# Altium schematic sheet catalog.SchDoc
size A4; Author: whutddk; DrawnBy: WHUTDDK; Revision: 1.0
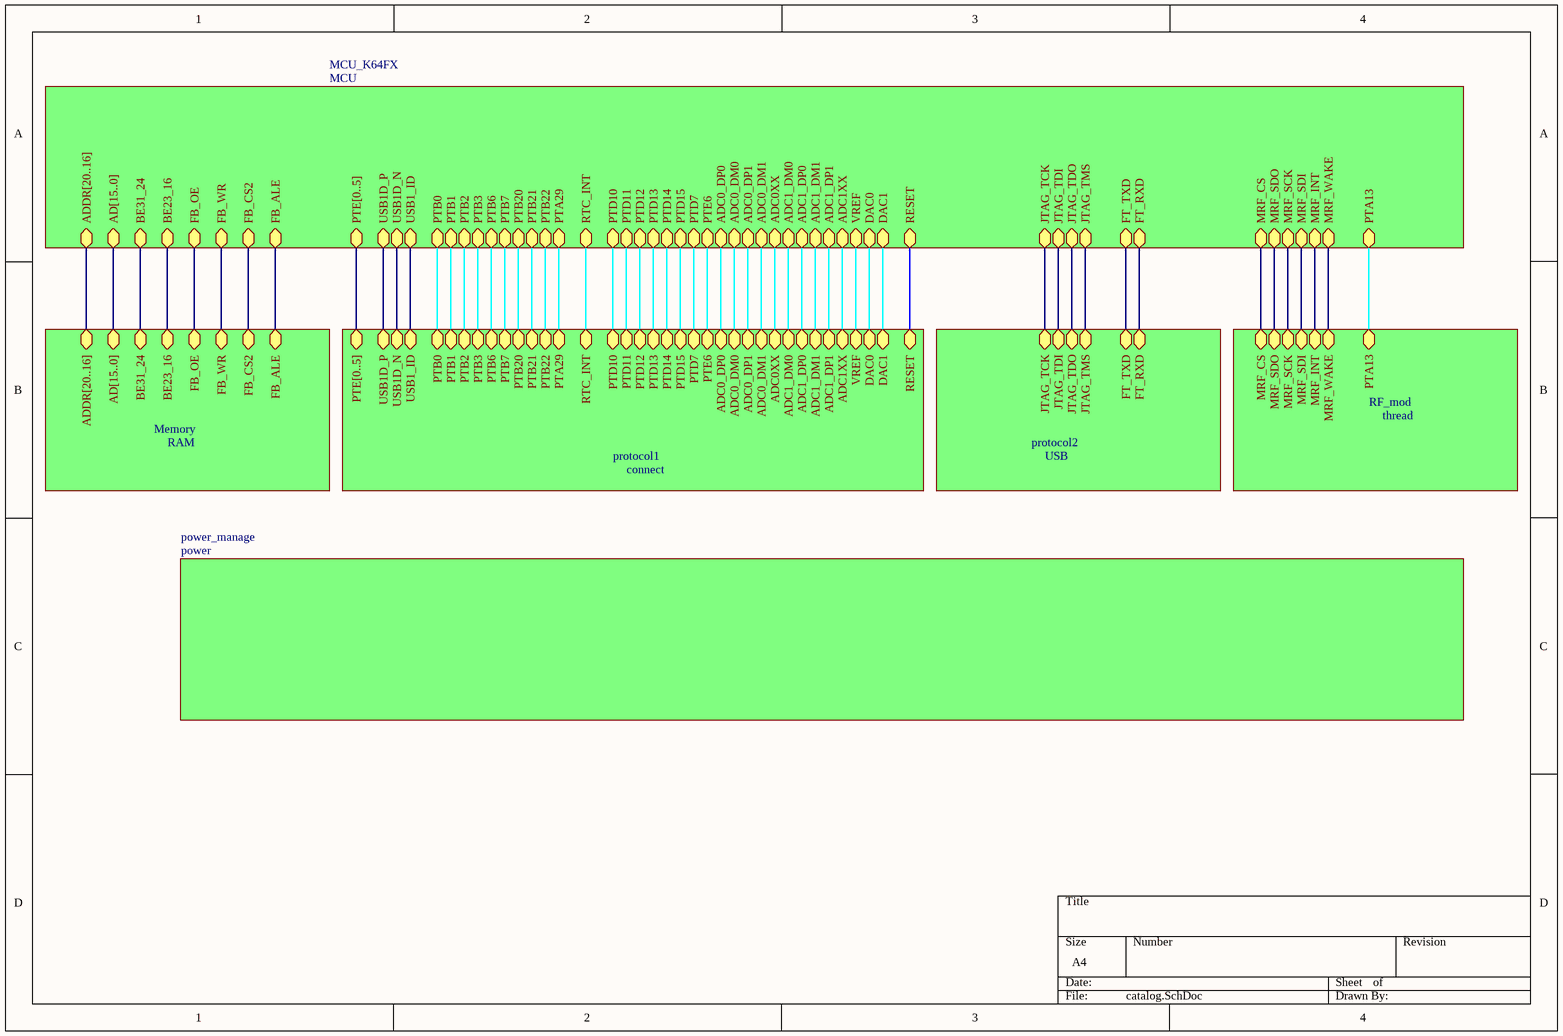
[diagram p0: catalog.SchDoc]

## Sub-sheets
MCU_K64FX = MCU: PTE[0..5], ADDR[20..16], AD[15..0], BE31_24, BE23_16, FB_OE, FB_WR, FB_CS2, FB_ALE, JTAG_TCK, JTAG_TDI, JTAG_TDO, JTAG_TMS, MRF_CS, MRF_SDO, MRF_SCK, MRF_SDI, MRF_INT, MRF_WAKE, USB1D_P, USB1D_N, USB1_ID, FT_TXD, FT_RXD, PTB0, PTB1, PTB2, PTB3, PTB6, PTB7, PTB20, PTB21, PTB22, PTA29, PTD12, PTD13, PTD14, PTD15, ADC0_DP0, ADC0_DM1, ADC0_DP1, ADC0_DM0, ADC0XX, ADC1_DM0, ADC1_DP0, ADC1_DM1, ADC1_DP1, VREF, DAC0, PTD11, PTD10, DAC1, PTD7, ADC1XX, PTA13, RTC_INT, RESET, PTE6
Memory = RAM: ADDR[20..16], AD[15..0], BE31_24, BE23_16, FB_OE, FB_WR, FB_CS2, FB_ALE
power_manage = power: no entries
protocol1 = connect: PTE[0..5], USB1D_P, USB1D_N, USB1_ID, PTB0, PTB1, PTB2, PTB3, PTB6, PTB7, PTB20, PTB21, PTB22, PTA29, PTD12, PTD13, PTD14, PTD15, ADC0_DP0, ADC0_DM1, ADC0_DP1, ADC0_DM0, ADC0XX, ADC1_DM0, ADC1_DP0, ADC1_DM1, ADC1_DP1, VREF, DAC0, PTD11, PTD10, DAC1, PTD7, ADC1XX, RTC_INT, RESET, PTE6
protocol2 = USB: JTAG_TCK, JTAG_TDI, JTAG_TDO, JTAG_TMS, FT_TXD, FT_RXD
RF_mod = thread: MRF_CS, MRF_SDO, MRF_SCK, MRF_SDI, MRF_INT, MRF_WAKE, PTA13

## Nets
(unnamed): sheet MCU_K64FX/BE31_24, sheet Memory/BE31_24
(unnamed): sheet MCU_K64FX/BE23_16, sheet Memory/BE23_16
(unnamed): sheet MCU_K64FX/FB_OE, sheet Memory/FB_OE
(unnamed): sheet MCU_K64FX/FB_WR, sheet Memory/FB_WR
(unnamed): sheet MCU_K64FX/FB_CS2, sheet Memory/FB_CS2
(unnamed): sheet MCU_K64FX/FB_ALE, sheet Memory/FB_ALE
(unnamed): sheet MCU_K64FX/JTAG_TCK, sheet protocol2/JTAG_TCK
(unnamed): sheet MCU_K64FX/JTAG_TDI, sheet protocol2/JTAG_TDI
(unnamed): sheet MCU_K64FX/JTAG_TDO, sheet protocol2/JTAG_TDO
(unnamed): sheet MCU_K64FX/JTAG_TMS, sheet protocol2/JTAG_TMS
(unnamed): sheet MCU_K64FX/MRF_CS, sheet RF_mod/MRF_CS
(unnamed): sheet MCU_K64FX/MRF_SDO, sheet RF_mod/MRF_SDO
(unnamed): sheet MCU_K64FX/MRF_SCK, sheet RF_mod/MRF_SCK
(unnamed): sheet MCU_K64FX/MRF_SDI, sheet RF_mod/MRF_SDI
(unnamed): sheet MCU_K64FX/MRF_INT, sheet RF_mod/MRF_INT
(unnamed): sheet MCU_K64FX/MRF_WAKE, sheet RF_mod/MRF_WAKE
(unnamed): sheet MCU_K64FX/USB1D_P, sheet protocol1/USB1D_P
(unnamed): sheet MCU_K64FX/USB1D_N, sheet protocol1/USB1D_N
(unnamed): sheet MCU_K64FX/USB1_ID, sheet protocol1/USB1_ID
(unnamed): sheet MCU_K64FX/FT_TXD, sheet protocol2/FT_TXD
(unnamed): sheet MCU_K64FX/FT_RXD, sheet protocol2/FT_RXD
(unnamed): sheet MCU_K64FX/PTB0, sheet protocol1/PTB0
(unnamed): sheet MCU_K64FX/PTB1, sheet protocol1/PTB1
(unnamed): sheet MCU_K64FX/PTB2, sheet protocol1/PTB2
(unnamed): sheet MCU_K64FX/PTB3, sheet protocol1/PTB3
(unnamed): sheet MCU_K64FX/PTB6, sheet protocol1/PTB6
(unnamed): sheet MCU_K64FX/PTB7, sheet protocol1/PTB7
(unnamed): sheet MCU_K64FX/PTB20, sheet protocol1/PTB20
(unnamed): sheet MCU_K64FX/PTB21, sheet protocol1/PTB21
(unnamed): sheet MCU_K64FX/PTB22, sheet protocol1/PTB22
(unnamed): sheet MCU_K64FX/PTA29, sheet protocol1/PTA29
(unnamed): sheet MCU_K64FX/PTD12, sheet protocol1/PTD12
(unnamed): sheet MCU_K64FX/PTD13, sheet protocol1/PTD13
(unnamed): sheet MCU_K64FX/PTD14, sheet protocol1/PTD14
(unnamed): sheet MCU_K64FX/PTD15, sheet protocol1/PTD15
(unnamed): sheet MCU_K64FX/ADC0_DP0, sheet protocol1/ADC0_DP0
(unnamed): sheet MCU_K64FX/ADC0_DM1, sheet protocol1/ADC0_DM1
(unnamed): sheet MCU_K64FX/ADC0_DP1, sheet protocol1/ADC0_DP1
(unnamed): sheet MCU_K64FX/ADC0_DM0, sheet protocol1/ADC0_DM0
(unnamed): sheet MCU_K64FX/ADC0XX, sheet protocol1/ADC0XX
(unnamed): sheet MCU_K64FX/ADC1_DM0, sheet protocol1/ADC1_DM0
(unnamed): sheet MCU_K64FX/ADC1_DP0, sheet protocol1/ADC1_DP0
(unnamed): sheet MCU_K64FX/ADC1_DM1, sheet protocol1/ADC1_DM1
(unnamed): sheet MCU_K64FX/ADC1_DP1, sheet protocol1/ADC1_DP1
(unnamed): sheet MCU_K64FX/VREF, sheet protocol1/VREF
(unnamed): sheet MCU_K64FX/DAC0, sheet protocol1/DAC0
(unnamed): sheet MCU_K64FX/PTD11, sheet protocol1/PTD11
(unnamed): sheet MCU_K64FX/PTD10, sheet protocol1/PTD10
(unnamed): sheet MCU_K64FX/DAC1, sheet protocol1/DAC1
(unnamed): sheet MCU_K64FX/PTD7, sheet protocol1/PTD7
(unnamed): sheet MCU_K64FX/ADC1XX, sheet protocol1/ADC1XX
(unnamed): sheet MCU_K64FX/PTA13, sheet RF_mod/PTA13
(unnamed): sheet MCU_K64FX/RTC_INT, sheet protocol1/RTC_INT
(unnamed): sheet MCU_K64FX/RESET, sheet protocol1/RESET
(unnamed): sheet MCU_K64FX/PTE6, sheet protocol1/PTE6

## Buses and harness runs
bus sheet MCU_K64FX/AD[15..0] = sheet Memory/AD[15..0]
bus sheet MCU_K64FX/ADDR[20..16] = sheet Memory/ADDR[20..16]
bus sheet MCU_K64FX/PTE[0..5] = sheet protocol1/PTE[0..5]